# Altium schematic sheet MainCon.SchDoc
size A4
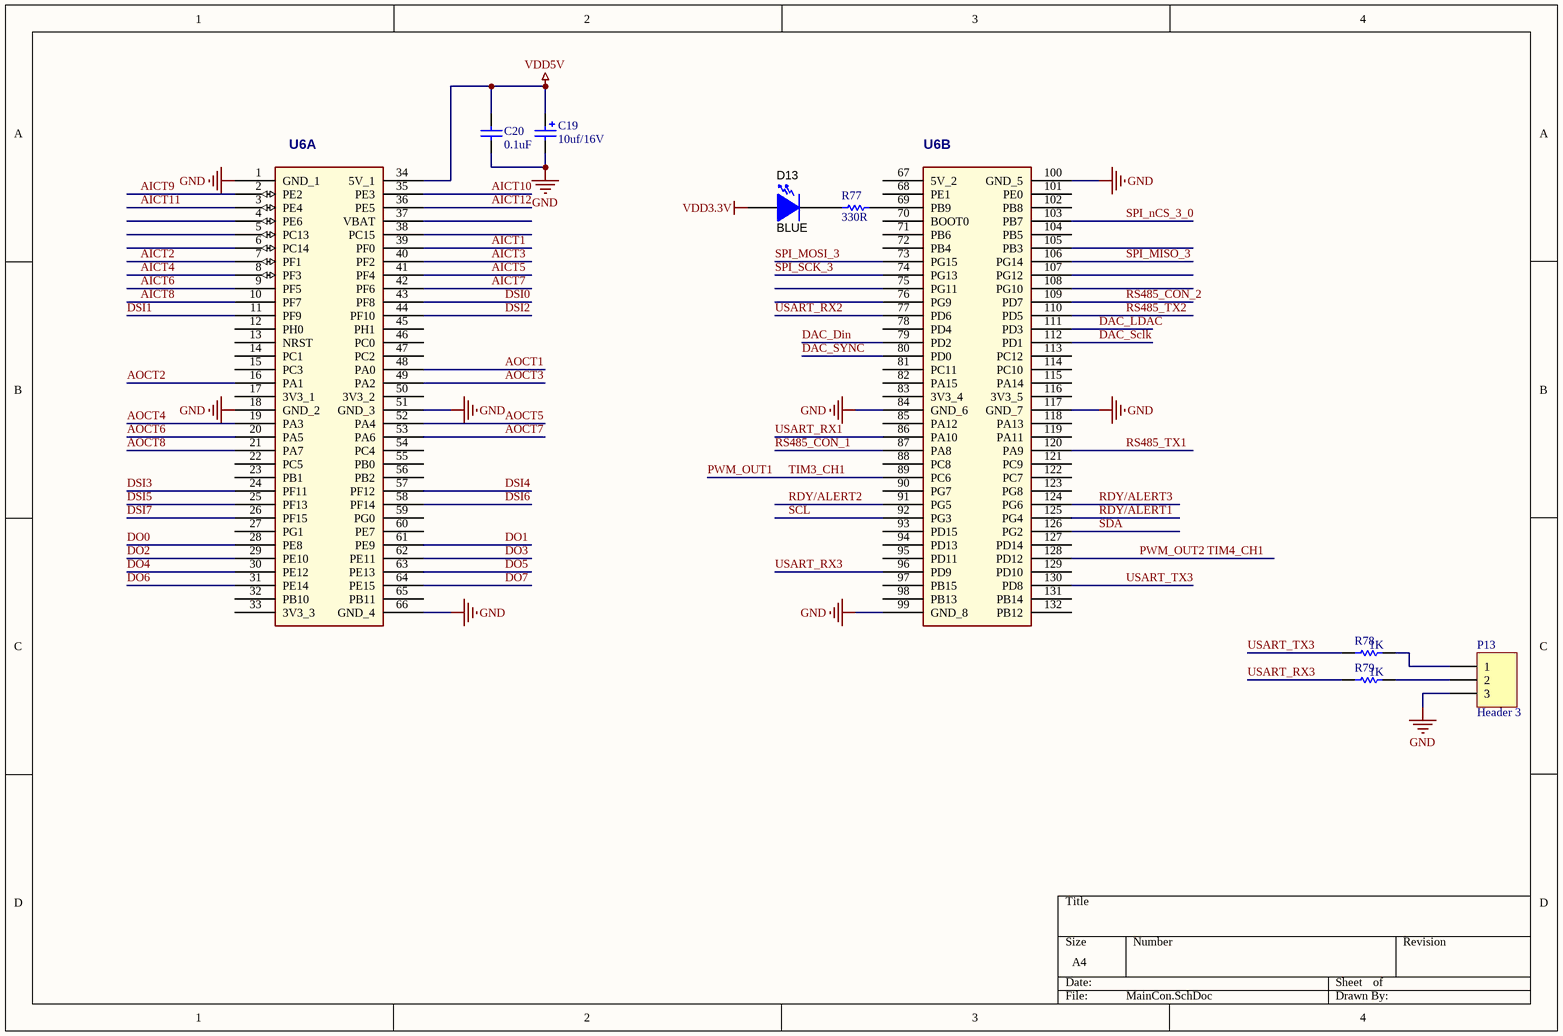
[diagram p0: MainCon.SchDoc]

## Parts
C19  value 10uf/16V  [Cap-A]
C20  value 0.1uF  [C0805]  (hidden comment: Cap)
D13  value BLUE  [D0805]  (hidden comment: SML-P12YTT86)
P13  Header 3  [HDR1X3]
R77  value 330R  [0805]  (hidden comment: Res Semi)
R78  value 1K  [0805]  (hidden comment: Res1)
R79  value 1K  [0805]  (hidden comment: Res1)
U6  STM32Z_MOD  [STM32VEMOD]  (value not drawn)  (parts A,B of 2)

## Nets
GND: C19.2 C20.1 P13.3 U6.1(GND_1) U6.18(GND_2) U6.51(GND_3) U6.66(GND_4) U6.84(GND_6) U6.99(GND_8) U6.100(GND_5) U6.117(GND_7)
VDD3.3V: D13.1(A)
VDD5V: C19.1 C20.2 U6.34(5V_1)
AICT1: U6.39(PF0)
AICT2: U6.7(PF1)
AICT3: U6.40(PF2)
AICT4: U6.8(PF3)
AICT5: U6.41(PF4)
AICT6: U6.9(PF5)
AICT7: U6.42(PF6)
AICT8: U6.10(PF7)
AICT9: U6.2(PE2)
AICT10: U6.35(PE3)
AICT11: U6.3(PE4)
AICT12: U6.36(PE5)
AOCT1: U6.48(PA0)
AOCT2: U6.16(PA1)
AOCT3: U6.49(PA2)
AOCT4: U6.19(PA3)
AOCT5: U6.52(PA4)
AOCT6: U6.20(PA5)
AOCT7: U6.53(PA6)
AOCT8: U6.21(PA7)
DAC_Din: U6.79(PD2)
DAC_LDAC: U6.111(PD3)
DAC_Sclk: U6.112(PD1)
DAC_SYNC: U6.80(PD0)
DO0: U6.28(PE8)
DO1: U6.61(PE9)
DO2: U6.29(PE10)
DO3: U6.62(PE11)
DO4: U6.30(PE12)
DO5: U6.63(PE13)
DO6: U6.31(PE14)
DO7: U6.64(PE15)
DSI0: U6.43(PF8)
DSI1: U6.11(PF9)
DSI2: U6.44(PF10)
DSI3: U6.24(PF11)
DSI4: U6.57(PF12)
DSI5: U6.25(PF13)
DSI6: U6.58(PF14)
DSI7: U6.26(PF15)
PWM_OUT1: U6.89(PC6)  [also labelled TIM3_CH1]
PWM_OUT2: U6.128(PD12)  [also labelled TIM4_CH1]
RDY/ALERT1: U6.125(PG4)
RDY/ALERT2: U6.91(PG5)
RDY/ALERT3: U6.124(PG6)
RS485_CON_1: U6.87(PA8)
RS485_CON_2: U6.109(PD7)
RS485_TX1: U6.120(PA9)
RS485_TX2: U6.110(PD5)
SCL: U6.92(PG3)
SDA: U6.126(PG2)
SPI_MISO_3: U6.106(PG14)
SPI_MOSI_3: U6.73(PG15)
SPI_nCS_3_0: U6.103(PB7)
SPI_SCK_3: U6.74(PG13)
USART_RX1: U6.86(PA10)
USART_RX2: U6.77(PD6)
USART_RX3: R79.1 U6.96(PD9)
USART_TX3: R78.1 U6.130(PD8)
NetD13_2: D13.2(K) R77.2
NetP13_1: P13.1 R78.2
NetP13_2: P13.2 R79.2
NetR77_1: R77.1 U6.69(PB9)

Not connected (* = marked no-connect by the designer): U6 4(PE6) 5(PC13) 6(PC14) 12(PH0) 13(NRST) 14(PC1) 15(PC3) 17(3V3_1) 22(PC5) 23(PB1) 27(PG1) 32(PB10) 33(3V3_3) 37(VBAT) 38(PC15) 45(PH1) 46(PC0) 47(PC2) 50(3V3_2) 54(PC4) 55(PB0) 56(PB2) 59(PG0) 60(PE7) 65(PB11) 67(5V_2) 68(PE1) 70(BOOT0) 71(PB6) 72(PB4) 75(PG11) 76(PG9) 78(PD4) 81(PC11) 82(PA15) 83(3V3_4) 85(PA12) 88(PC8) 90(PG7) 93(PD15) 94(PD13) 95(PD11) 97(PB15) 98(PB13) 101(PE0) 102(PB8) 104(PB5) 105(PB3) 107(PG12) 108(PG10) 113(PC12) 114(PC10) 115(PA14) 116(3V3_5) 118(PA13) 119(PA11) 121(PC9) 122(PC7) 123(PG8) 127(PD14) 129(PD10) 131(PB14) 132(PB12)

## Library data of the parts
C19 = Cap Pol2: Polarized Capacitor (Axial); Published: 8-Jun-2000; LatestRevisionDate: 17-Jul-2002; LatestRevisionNote: Re-released for DXP Platform.; PackageReference: POLAR0.8; Publisher: Altium Limited; PackageDescription: Polarized Capacitor; 2 Leads
C20 = Cap_2: Capacitor; Published: 8-Jun-2000; LatestRevisionDate: 17-Jul-2002; LatestRevisionNote: Re-released for DXP Platform.; Publisher: Altium Limited
D13 = SML-P12YTT86: LED, GREEN SMD; Manufacturer: Rohm; Type: InGaN; Vf_V: 2.1; Value2: 2.1V; Io_A: 0.02; Tjmax_C: 85; Value1: W; Color: yellow; U/M: EA; CompType: LED; PartNumber: SML-P12YTT86; SymbolVersion: 2008-12-08; MountType: SMT; RoHS: Y; PackageReference: Yellow LED; Published: 2008-07-11; Publisher: Texas Instruments; ComponentLink1URL: http://rohmfs.rohm.com/en/products/databook/datasheet/opto/led/chip_mono/sml-p1.pdf; ComponentLink1Description: Datasheet link; LatestRevisionDate: 2013-06-24; LatestRevisionNote: Updated supplier queries; Supplier 1: Digi-Key; Supplier Part Number 1: 511-1595-1-ND; Supplier 2: Mouser; Supplier Part Number 2: 755-SML-P12YTT86; Supplier 3: Farnell; Supplier Part Number 3: 1973107
P13 = Header 3: Header, 3-Pin; LatestRevisionDate: 17-Jul-2002; LatestRevisionNote: Re-released for DXP Platform.; Publisher: Altium Limited
R77 = Res Semi: Semiconductor Resistor; Published: 8-Jun-2000; LatestRevisionDate: 17-Jul-2002; LatestRevisionNote: Re-released for DXP Platform.; PackageReference: AXIAL-0.5; Publisher: Altium Limited
R78 R79 = Res1: Resistor; Published: 8-Jun-2000; LatestRevisionDate: 17-Jul-2002; LatestRevisionNote: Re-released for DXP Platform.; PackageReference: AXIAL-0.3; Publisher: Altium Limited
U6 = STM32Z_MOD: PCB Footprint SMD: 插件; TOLERANCE: =U5_TOLERANCE; Technology: 2mm，2X33插座